# EAGLE board aircat (EAGLE 6.1)
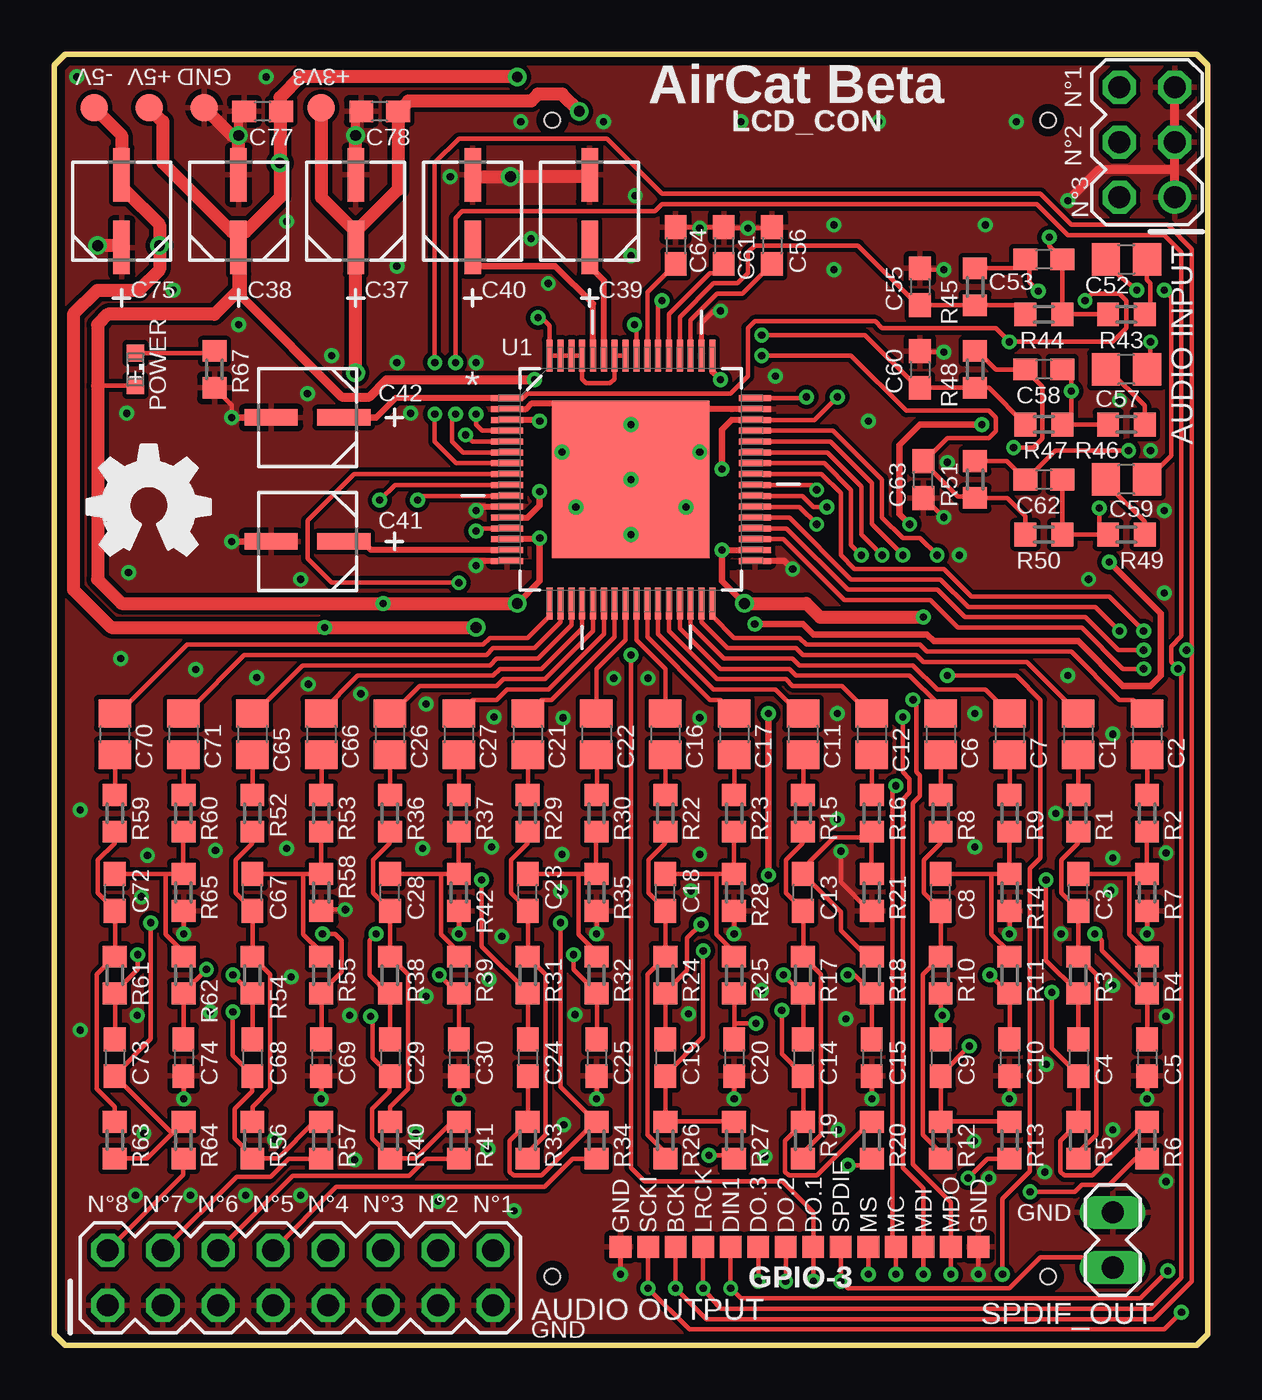
[diagram p2: board, top side]
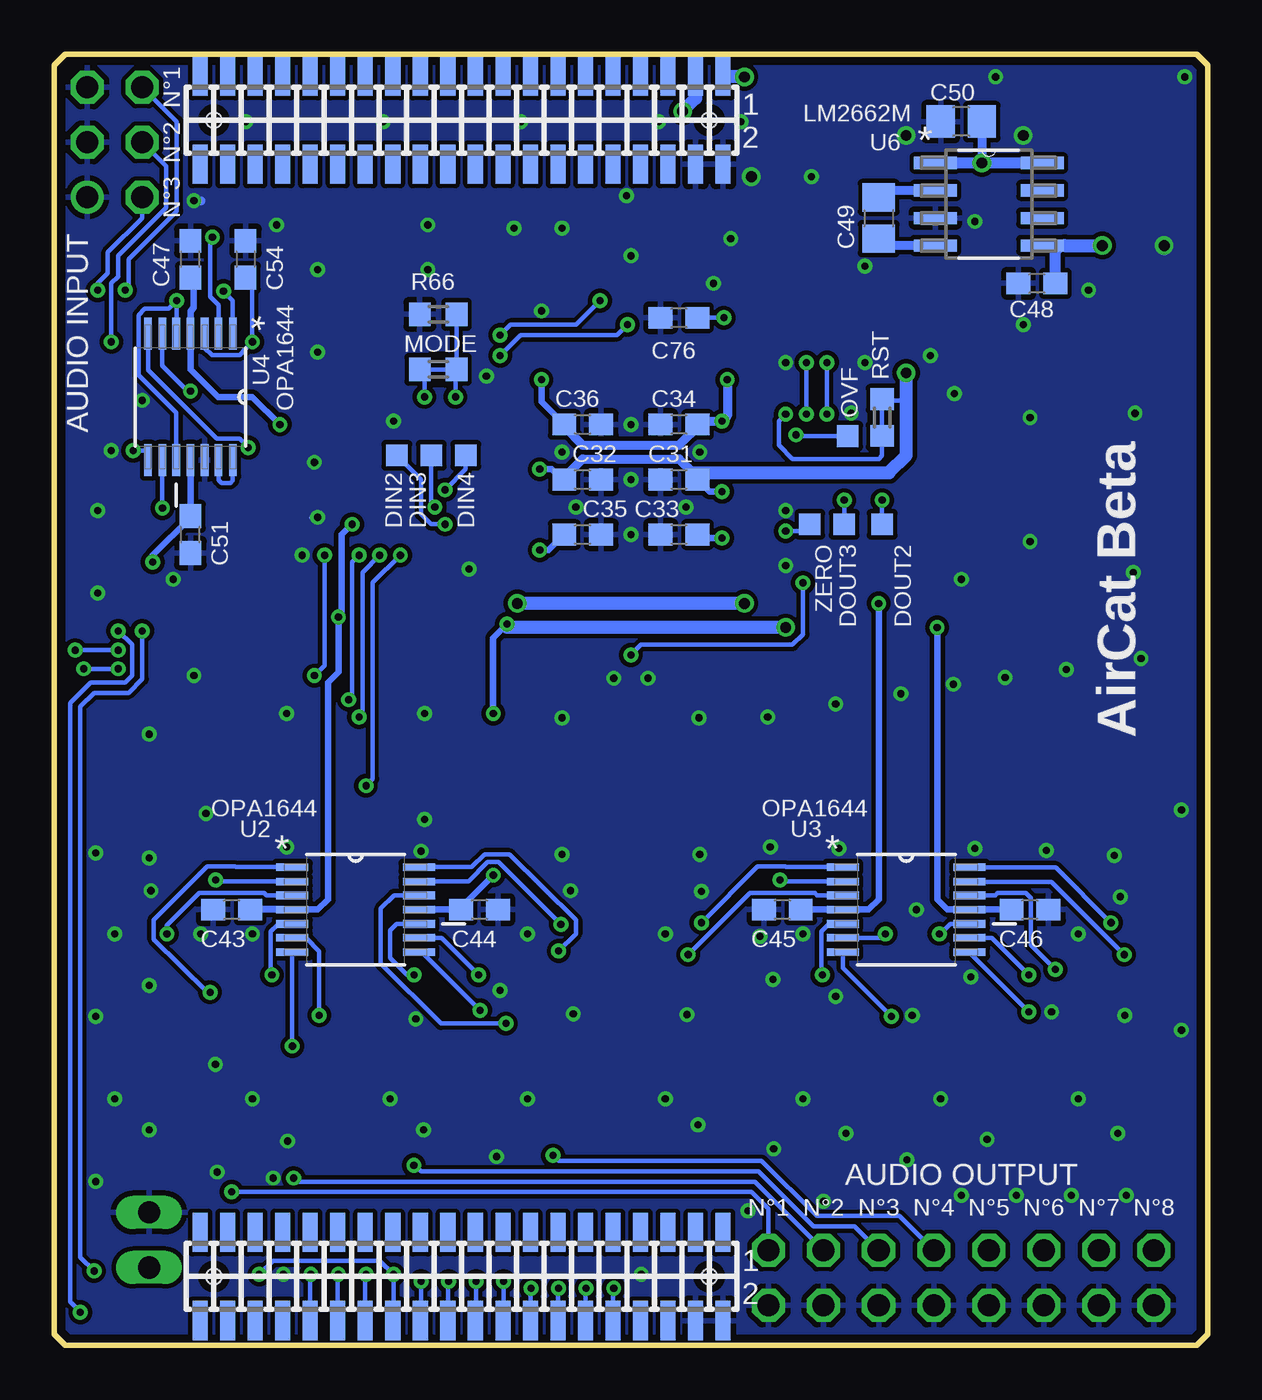
[diagram p3: board, bottom side, seen from below]

Size 53.21 x 59.56 mm. Coordinates in mm from the lower left corner, seen from the top.
Outline: 0,0.51 0,59.05 0.51,59.56 52.71,59.56 53.21,59.05 53.21,0.51 52.71,0 0.51,0 0,0.51
Copper layers (1*16): Top 0.0356mm / dielectric 1.5011mm / Bottom 0.0356mm
Design rules: minimum track width 6mil, minimum drill 13mil, track to track 6mil, track to pad 6mil, pad to pad 6mil, via to via 6mil, smd to smd 6mil, copper to edge 15mil, drill to drill 6mil, minimum pad ring 7mil, minimum via ring 7mil, stop-mask expansion 3mil, vias tented up to drill 0mil, thermal gap 10mil
Net classes: 0 default: width 0.203 mm, drill 0.33 mm
tRestrict: area 30.3,39.7 to 30.5,40.1; area 26.4,36.1 to 26.8,36.3; area 22.8,39.7 to 22.9,40.2; area 26.4,43.6 to 26.8,43.7; area 29.7,44.7 to 30,44.8; area 31.1,36 to 31.4,36.1; area 21.7,36 to 22,36.1; area 22.1,43.1 to 22.4,43.2; area 22.4,43.1 to 22.7,43.2; area 22.1,43.6 to 22.4,43.7; area 30.7,42.9 to 31,43; area 30.7,43.4 to 31,43.5; 1 more areas
bRestrict: area 15.2,42.5 to 15.5,43.1; area 14.5,42.5 to 14.9,43.1; area 35.2,45.2 to 35.8,45.7; area 35.2,44.4 to 35.8,44.9

## Footprints (pad centres in the part's own frame; a part is rotated, then mirrored left to right if it is on the bottom)
TP10SQ = smd 1 x 1: TP 0,0
C0805 = smd 1.3 x 1.5: 1 -0.95,0; 2 0.95,0
C0603 = smd 1.1 x 1: 1 -0.85,0; 2 0.85,0
CAPAE430X610N = smd 2.464 x 0.762: 1 -1.676,0; 2 1.676,0
A10_OLINUXINO_LIME_SHIELD = smd 0.7 x 1.8 bottom: 3-1 -4.255,-24.575; 3-2 -4.255,-28.639; 3-3 -2.985,-24.575; 3-4 -2.985,-28.639; 3-5 -1.714,-24.575; 3-6 -1.714,-28.639; 3-7 -0.445,-24.575; 3-8 -0.445,-28.639; 3-9 0.826,-24.575; 3-10 0.826,-28.639; 3-11 2.095,-24.575; 3-12 2.095,-28.639; 3-13 3.365,-24.575; 3-14 3.365,-28.639; 3-15 4.636,-24.575; 3-16 4.636,-28.639; 3-17 5.905,-24.575; 3-18 5.905,-28.639; 3-19 7.176,-24.575; 3-20 7.176,-28.639; 3-21 8.445,-24.575; 3-22 8.445,-28.639; 3-23 9.716,-24.575; 3-24 9.716,-28.639; 3-25 10.986,-24.575; 3-26 10.986,-28.639; 3-27 12.255,-24.575; 3-28 12.255,-28.639; 3-29 13.525,-24.575; 3-30 13.525,-28.639; 3-31 14.796,-24.575; 3-32 14.796,-28.639; 3-33 16.066,-24.575; 3-34 16.066,-28.639; 3-35 17.335,-24.575; 3-36 17.335,-28.639; 3-37 18.605,-24.575; 3-38 18.605,-28.639; 3-39 19.875,-24.575; 3-40 19.875,-28.639; D-1 -4.255,28.765; D-2 -4.255,24.701; D-3 -2.985,28.765; D-4 -2.985,24.701; D-5 -1.714,28.765; D-6 -1.714,24.701; D-7 -0.445,28.765; D-8 -0.445,24.701; D-9 0.826,28.765; D-10 0.826,24.701; D-11 2.095,28.765; D-12 2.095,24.701; D-13 3.365,28.765; D-14 3.365,24.701; D-15 4.636,28.765; D-16 4.636,24.701; D-17 5.905,28.765; D-18 5.905,24.701; D-19 7.176,28.765; D-20 7.176,24.701; D-21 8.445,28.765; D-22 8.445,24.701; D-23 9.716,28.765; D-24 9.716,24.701; D-25 10.986,28.765; D-26 10.986,24.701; D-27 12.255,28.765; D-28 12.255,24.701; D-29 13.525,28.765; D-30 13.525,24.701; D-31 14.796,28.765; D-32 14.796,24.701; D-33 16.066,28.765; D-34 16.066,24.701; D-35 17.335,28.765; D-36 17.335,24.701; D-37 18.605,28.765; D-38 18.605,24.701; D-39 19.875,28.765; D-40 19.875,24.701 | hole 0.7: -3.619,-26.607; 19.241,-26.607; -3.619,26.733; 19.241,26.733
MA08-2 = drill 1.016 octagon: 1 -8.89,-1.27; 2 -8.89,1.27; 3 -6.35,-1.27; 4 -6.35,1.27; 5 -3.81,-1.27; 6 -3.81,1.27; 7 -1.27,-1.27; 8 -1.27,1.27; 9 1.27,-1.27; 10 1.27,1.27; 11 3.81,-1.27; 12 3.81,1.27; 13 6.35,-1.27; 14 6.35,1.27; 15 8.89,-1.27; 16 8.89,1.27
MA03-2 = drill 1.016: 1 -2.54,-1.27 | drill 1.016 octagon: 2 -2.54,1.27; 3 0,-1.27; 4 0,1.27; 5 2.54,-1.27; 6 2.54,1.27
MA02-1 = drill 1.016 long: 1 -1.27,0; 2 1.27,0
R0603 = smd 1 x 1.1: 1 -0.85,0; 2 0.85,0
SML0603 = smd 0.8 x 0.8: A 0.75,0; C -0.75,0
B1,27 = smd 1.27 x 1.27: TP 0,0
QFP50P1200X1200X120-65N = smd 1.473 x 0.279: 1 -5.715,3.759; 2 -5.715,3.251; 3 -5.715,2.743; 4 -5.715,2.261; 5 -5.715,1.753; 6 -5.715,1.245; 7 -5.715,0.762; 8 -5.715,0.254; 9 -5.715,-0.254; 10 -5.715,-0.762; 11 -5.715,-1.245; 12 -5.715,-1.753; 13 -5.715,-2.261; 14 -5.715,-2.743; 15 -5.715,-3.251; 16 -5.715,-3.759; 33 5.715,-3.759; 34 5.715,-3.251; 35 5.715,-2.743; 36 5.715,-2.261; 37 5.715,-1.753; 38 5.715,-1.245; 39 5.715,-0.762; 40 5.715,-0.254; 41 5.715,0.254; 42 5.715,0.762; 43 5.715,1.245; 44 5.715,1.753; 45 5.715,2.261; 46 5.715,2.743; 47 5.715,3.251; 48 5.715,3.759 | smd 0.279 x 1.473: 17 -3.759,-5.715; 18 -3.251,-5.715; 19 -2.743,-5.715; 20 -2.261,-5.715; 21 -1.753,-5.715; 22 -1.245,-5.715; 23 -0.762,-5.715; 24 -0.254,-5.715; 25 0.254,-5.715; 26 0.762,-5.715; 27 1.245,-5.715; 28 1.753,-5.715; 29 2.261,-5.715; 30 2.743,-5.715; 31 3.251,-5.715; 32 3.759,-5.715; 49 3.759,5.715; 50 3.251,5.715; 51 2.743,5.715; 52 2.261,5.715; 53 1.753,5.715; 54 1.245,5.715; 55 0.762,5.715; 56 0.254,5.715; 57 -0.254,5.715; 58 -0.762,5.715; 59 -1.245,5.715; 60 -1.753,5.715; 61 -2.261,5.715; 62 -2.743,5.715; 63 -3.251,5.715; 64 -3.759,5.715 | smd 7.264 x 7.264: 65 0,0
SOP65P640X120-14N = smd 1.473 x 0.356: 1 -2.921,1.956; 2 -2.921,1.295; 3 -2.921,0.66; 4 -2.921,0; 5 -2.921,-0.66; 6 -2.921,-1.295; 7 -2.921,-1.956; 8 2.921,-1.956; 9 2.921,-1.295; 10 2.921,-0.66; 11 2.921,0; 12 2.921,0.66; 13 2.921,1.295; 14 2.921,1.956
SOIC127P620X175-8N = smd 1.981 x 0.559: 1 -2.464,1.905; 2 -2.464,0.635; 3 -2.464,-0.635; 4 -2.464,-1.905; 5 2.464,-1.905; 6 2.464,-0.635; 7 2.464,0.635; 8 2.464,1.905

## Placement (x,y rotation side)
BCKAD/DA  [TP10SQ]  28.67,4.54 0 top
C1  10µF 16V  [C0805]  47.24,28.19 270 top
C2  10µF 16V  [C0805]  50.42,28.19 270 top
C3  3300pF  [C0603]  47.24,20.89 90 top
C4  680pF  [C0603]  47.24,13.27 270 top
C5  680pF  [C0603]  50.42,13.27 270 top
C6  10µF 16V  [C0805]  40.89,28.19 270 top
C7  10µF 16V  [C0805]  44.07,28.19 270 top
C8  3300pF  [C0603]  40.89,20.89 90 top
C9  680pF  [C0603]  40.89,13.27 270 top
C10  680pF  [C0603]  44.07,13.27 270 top
C11  10µF 16V  [C0805]  34.54,28.19 270 top
C12  10µF 16V  [C0805]  37.72,28.19 270 top
C13  3300pF  [C0603]  34.54,20.89 90 top
C14  680pF  [C0603]  34.54,13.27 270 top
C15  680pF  [C0603]  37.72,13.27 270 top
C16  10µF 16V  [C0805]  28.19,28.19 270 top
C17  10µF 16V  [C0805]  31.37,28.19 270 top
C18  3300pF  [C0603]  28.19,20.89 90 top
C19  680pF  [C0603]  28.19,13.27 270 top
C20  680pF  [C0603]  31.37,13.27 270 top
C21  10µF 16V  [C0805]  21.84,28.19 270 top
C22  10µF 16V  [C0805]  25.02,28.19 270 top
C23  3300pF  [C0603]  21.84,20.89 90 top
C24  680pF  [C0603]  21.84,13.27 270 top
C25  680pF  [C0603]  25.02,13.27 270 top
C26  10µF 16V  [C0805]  15.49,28.19 270 top
C27  10µF 16V  [C0805]  18.67,28.19 270 top
C28  3300pF  [C0603]  15.49,20.89 90 top
C29  680pF  [C0603]  15.49,13.27 270 top
C30  680pF  [C0603]  18.67,13.27 270 top
C31  1µF  [C0603]  24.38,39.94 180 bottom
C32  1µF  [C0603]  28.83,39.94 0 bottom
C33  1µF  [C0603]  24.38,37.4 180 bottom
C34  1µF  [C0603]  24.38,42.48 180 bottom
C35  1µF  [C0603]  28.83,37.4 0 bottom
C36  1µF  [C0603]  28.83,42.48 0 bottom
C37  10µF  [CAPAE430X610N]  13.91,52.32 90 top
C38  10µF  [CAPAE430X610N]  8.51,52.32 90 top
C39  10µF  [CAPAE430X610N]  24.7,52.32 90 top
C40  10µF  [CAPAE430X610N]  19.3,52.32 90 top
C41  10µF  [CAPAE430X610N]  11.68,37.08 180 top
C42  10µF  [CAPAE430X610N]  11.68,42.8 180 top
C43  1µF  [C0603]  45.02,20.1 180 bottom
C44  1µF  [C0603]  33.59,20.1 180 bottom
C45  1µF  [C0603]  19.62,20.1 180 bottom
C46  1µF  [C0603]  8.19,20.1 180 bottom
C47  1µF  [C0603]  46.93,50.1 90 bottom
C48  100nF  [C0603]  7.87,48.99 180 bottom
C49  10µF  [C0805]  15.18,52.01 270 bottom
C50  10µF  [C0805]  11.37,56.45 180 bottom
C51  1µF  [C0603]  46.93,37.4 90 bottom
C52  10µF 16V  [C0805]  49.47,50.1 0 top
C53  2.2nF  [C0603]  45.66,50.1 180 top
C54  0.1µF  [C0603]  44.39,50.1 270 bottom
C55  22nF  [C0603]  39.94,48.83 270 top
C56  22nF  [C0603]  33.12,50.74 270 top
C57  10µF 16V  [C0805]  49.47,45.02 180 top
C58  2.2nF  [C0603]  45.66,45.02 180 top
C59  10µF 16V  [C0805]  49.47,39.94 180 top
C60  22nF  [C0603]  39.94,45.02 270 top
C61  22nF  [C0603]  30.89,50.74 270 top
C62  2.2nF  [C0603]  45.66,39.94 180 top
C63  22nF  [C0603]  40.1,39.94 90 top
C64  22nF  [C0603]  28.67,50.74 270 top
C65  10µF 16V  [C0805]  9.14,28.19 270 top
C66  10µF 16V  [C0805]  12.32,28.19 270 top
C67  3300pF  [C0603]  9.14,20.89 90 top
C68  680pF  [C0603]  9.14,13.27 270 top
C69  680pF  [C0603]  12.32,13.27 270 top
C70  10µF 16V  [C0805]  2.79,28.19 270 top
C71  10µF 16V  [C0805]  5.97,28.19 270 top
C72  3300pF  [C0603]  2.79,20.89 90 top
C73  680pF  [C0603]  2.79,13.27 270 top
C74  680pF  [C0603]  5.97,13.27 270 top
C75  10µF  [CAPAE430X610N]  3.11,52.32 90 top
C76  0.001-1µF  [C0603]  24.38,47.4 180 bottom
C77  100nF  [C0603]  9.62,56.93 180 top
C78  100nF  [C0603]  15.02,56.93 180 top
CON1  A10_OLINUXINO_LIME_SHIELD_TEMPLATE  [A10_OLINUXINO_LIME_SHIELD]  26.61,29.78 0 top
CON2  ANALOG_OUT  [MA08-2]  11.37,3.11 0 top
CON3  ANALOG_IN  [MA03-2]  50.42,55.5 90 top
CON4  SPDIF_OUT  [MA02-1]  48.83,4.86 270 top
DIN1  [TP10SQ]  31.21,4.54 0 top
DIN2  [TP10SQ]  37.4,41.05 180 bottom
DIN3  [TP10SQ]  35.81,41.05 180 bottom
DIN4  [TP10SQ]  34.23,41.05 180 bottom
DOUT1  [TP10SQ]  35.02,4.54 0 top
DOUT2  [TP10SQ]  15.02,37.88 0 bottom
DOUT2(NC)  TPTP10SQ  [TP10SQ]  33.75,4.54 0 top
DOUT3  [TP10SQ]  16.76,37.88 0 bottom
DOUT3(NC)  TPTP10SQ  [TP10SQ]  32.48,4.54 0 top
GND@1  TPTP10SQ  [TP10SQ]  26.13,4.54 0 top
GND@2  TPTP10SQ  [TP10SQ]  42.64,4.54 0 top
LOGO1  OSHW_LOGO_FILLX0200-NT  [OSHW_FILLX200_NOTEXT]  1.52,36.45 0 top
LRCKAD/DA  [TP10SQ]  29.94,4.54 0 top
MC  [TP10SQ]  38.83,4.54 0 top
MDI  [TP10SQ]  40.1,4.54 0 top
MDO  [TP10SQ]  41.37,4.54 0 top
MODE  0 Ohm  [R0603]  35.5,45.02 0 bottom
MS  [TP10SQ]  37.56,4.54 0 top
OVF  TPTP10SQ  [TP10SQ]  16.61,41.95 0 bottom
POWER  [SML0603]  3.75,45.02 270 top
R1  7.5k  [R0603]  47.24,24.54 270 top
R2  7.5k  [R0603]  50.42,24.54 270 top
R3  360  [R0603]  47.24,17.08 270 top
R4  360  [R0603]  50.42,17.08 270 top
R5  5.6k  [R0603]  47.24,9.46 90 top
R6  47  [R0603]  50.42,9.46 270 top
R7  5.6k  [R0603]  50.42,20.89 90 top
R8  7.5k  [R0603]  40.89,24.54 270 top
R9  7.5k  [R0603]  44.07,24.54 270 top
R10  360  [R0603]  40.89,17.08 270 top
R11  360  [R0603]  44.07,17.08 270 top
R12  5.6k  [R0603]  40.89,9.46 90 top
R13  47  [R0603]  44.07,9.46 270 top
R14  5.6k  [R0603]  44.07,20.89 90 top
R15  7.5k  [R0603]  34.54,24.54 270 top
R16  7.5k  [R0603]  37.72,24.54 270 top
R17  360  [R0603]  34.54,17.08 270 top
R18  360  [R0603]  37.72,17.08 270 top
R19  5.6k  [R0603]  34.54,9.46 90 top
R20  47  [R0603]  37.72,9.46 270 top
R21  5.6k  [R0603]  37.72,20.89 90 top
R22  7.5k  [R0603]  28.19,24.54 270 top
R23  7.5k  [R0603]  31.37,24.54 270 top
R24  360  [R0603]  28.19,17.08 270 top
R25  360  [R0603]  31.37,17.08 270 top
R26  5.6k  [R0603]  28.19,9.46 90 top
R27  47  [R0603]  31.37,9.46 270 top
R28  5.6k  [R0603]  31.37,20.89 90 top
R29  7.5k  [R0603]  21.84,24.54 270 top
R30  7.5k  [R0603]  25.02,24.54 270 top
R31  360  [R0603]  21.84,17.08 270 top
R32  360  [R0603]  25.02,17.08 270 top
R33  5.6k  [R0603]  21.84,9.46 90 top
R34  47  [R0603]  25.02,9.46 270 top
R35  5.6k  [R0603]  25.02,20.89 90 top
R36  7.5k  [R0603]  15.49,24.54 270 top
R37  7.5k  [R0603]  18.67,24.54 270 top
R38  360  [R0603]  15.49,17.08 270 top
R39  360  [R0603]  18.67,17.08 270 top
R40  5.6k  [R0603]  15.49,9.46 270 top
R41  47  [R0603]  18.67,9.46 270 top
R42  5.6k  [R0603]  18.67,20.89 90 top
R43  3k  [R0603]  49.47,47.56 180 top
R44  1.5k  [R0603]  45.66,47.56 180 top
R45  1.5k  [R0603]  42.48,48.83 270 top
R46  3k  [R0603]  49.47,42.48 180 top
R47  1.5k  [R0603]  45.66,42.48 180 top
R48  1.5k  [R0603]  42.48,45.02 270 top
R49  3k  [R0603]  49.47,37.4 180 top
R50  1.5k  [R0603]  45.66,37.4 180 top
R51  1.5k  [R0603]  42.48,39.94 270 top
R52  7.5k  [R0603]  9.14,24.54 270 top
R53  7.5k  [R0603]  12.32,24.54 270 top
R54  360  [R0603]  9.14,17.08 270 top
R55  360  [R0603]  12.32,17.08 270 top
R56  5.6k  [R0603]  9.14,9.46 270 top
R57  47  [R0603]  12.32,9.46 270 top
R58  5.6k  [R0603]  12.32,20.89 90 top
R59  7.5k  [R0603]  2.79,24.54 270 top
R60  7.5k  [R0603]  5.97,24.54 270 top
R61  360  [R0603]  2.79,17.08 270 top
R62  360  [R0603]  5.97,17.08 270 top
R63  5.6k  [R0603]  2.79,9.46 270 top
R64  47  [R0603]  5.97,9.46 270 top
R65  5.6k  [R0603]  5.97,20.89 90 top
R66  220k  [R0603]  35.5,47.56 0 bottom
R67  150  [R0603]  7.4,45.02 90 top
RST  0 Ohm  [R0603]  15.02,42.8 90 bottom
SCKI  [TP10SQ]  27.4,4.54 0 top
SPDIF_DO  TPTP10SQ  [TP10SQ]  36.29,4.54 0 top
TP1  -5V  [B1,27]  1.84,57.09 0 top
TP2  +5V  [B1,27]  4.38,57.09 0 top
TP3  GND  [B1,27]  6.92,57.09 0 top
TP4  +3V3  [B1,27]  12.32,57.09 0 top
U1  PCM3168A  [QFP50P1200X1200X120-65N]  26.61,39.94 0 top
U2  OPA1644AIPW  [SOP65P640X120-14N]  39.31,20.1 0 bottom
U3  OPA1644AIPW  [SOP65P640X120-14N]  13.91,20.1 0 bottom
U4  OPA1644AIPW  [SOP65P640X120-14N]  46.93,43.75 270 bottom
U6  LM2662M  [SOIC127P620X175-8N]  10.1,52.64 0 bottom
ZERO  [TP10SQ]  18.35,37.88 0 bottom

## Tracks (layer width: path | path; a pad name or v marks a point on that pad's centre or on a via)
+3V3  (via drill 0.33, 0.5)
  Top 0.203: U1.4 19.74,42.2 19.46,42.48 v19.46,42.96 | U1.48 34.65,43.7 v34.7,43.75 | U1.46 35.06,42.68 v36.13,43.75
  Top 0.279: U1.12 21.84,38.19 | U1.46 31.25,42.68
  Top 0.305: 21.84,38.19 22.4,38.75 v22.4,39.39 | 31.25,42.68 30.81,42.24 v30.81,40.42
  Top 0.61: v24.23,56.93 23.43,57.72 22.32,57.72 22,57.4 16.34,57.4 C78.1 15.87,53.33 13.91,51.37 | v13.91,44.86 C37.1 13.91,51.37 | TP4.TP 12.32,52.96 13.91,51.37
  Bottom 0.203: 13.91,43.59 15.02,43.59 RST.2 RST.1 15.02,41.05 15.18,40.89 19.15,40.89 19.78,41.53 19.78,42.64 v19.46,42.96 | v34.7,43.75 34.7,45.02 | 34.7,45.02 MODE.2 R66.2 | MODE.1 36.13,44.81 v36.13,43.75 | 34.7,45.02 MODE.1 | 36.45,45.02 MODE.1
  Bottom 0.305: v22.4,39.39 22.98,39.39 C31.1 | v30.81,40.42 30.26,40.42 29.78,39.94
  Bottom 0.406: C32.1 29.78,39.94 28.83,40.89 24.38,40.89 23.75,40.26 23.69,40.26 C31.1
  Bottom 0.61: CON1.D-3 23.62,57.53 v24.23,56.93 | 23.69,40.26 14.7,40.26 13.91,41.05 13.91,43.59 v13.91,44.86
+5V  (via drill 0.33, 0.5)
  Top 0.203: POWER.A 2,44.27
  Top 0.279: 22.36,42.68 U1.3 | 30.98,36.69 U1.34 | 22.36,37.2 U1.14 | U1.49 30.37,44.91 v30.73,44.55
  Top 0.305: v22.4,42.64 22.36,42.68 | 30.98,36.69 v30.81,36.69 30.81,35.26 v31.85,34.23 | 22.36,37.2 v22.4,37.24 22.4,35.26 v21.37,34.23 | v42.8,42.48 39.94,42.48 38.99,41.53 38.99,38.35 v39.47,37.88
  Top 0.406: 8.51,48.67 8.51,49.31 8.67,49.47 8.67,48.36 13.27,43.75 14.54,43.75 15.34,44.55 v22.16,44.55 | C77.1 10.41,57.56
  Top 0.61: 8.51,51.37 C38.1 8.51,48.67 7.4,47.56 2.48,47.56 2,47.09 2,44.27 2,35.34 3.11,34.23 v15.18,34.23 v21.37,34.23 | 8.51,51.37 8.51,51.47 | v21.37,58.52 11.37,58.52 10.41,57.56 v10.41,54.55 10.41,52.96 8.83,51.37 8.51,51.37 | 8.51,51.37 8.19,51.37 5.02,54.55 5.02,56.45 TP2.TP | v31.85,34.23 34.7,34.23 35.34,33.59 v40.1,33.59
  Bottom 0.203: 29.7,37.4 C35.1 29.62,37.4 | v10.41,54.55 v10.42,54.55 10.42,54.63
  Bottom 0.305: C34.1 23.27,42.48 23.11,42.64 | C33.1 23.06,37.24 v22.4,37.24 | C47.1 46.77,48.99 46.77,47.88 46.93,47.72 U4.4 46.93,45.02 45.66,43.75 44.07,43.75 v42.8,42.48 | C45.1 U3.4 16.7,20.1 | C45.1 18.99,20.1 | v15.18,34.23 15.18,20.57 15.65,20.1 16.7,20.1 | 18.99,20.31 C45.1 | 16.7,20.1 16.76,20.1 | U2.4 41.05,20.1 40.58,20.57 40.58,30.58 40.1,31.05 v40.1,33.59 39.94,33.75 39.94,37.4 v39.47,37.88 | v30.73,44.55 30.73,43.54 C36.1 | v30.81,36.69 30.42,36.69 29.7,37.4
  Bottom 0.33: U2.4 C43.1
  Bottom 0.406: C50.1 10.42,54.63 | 23.11,42.64 v22.4,42.64 22.16,42.88 v22.16,44.55 | 29.65,42.35 28.83,41.53 24.38,41.53 23.43,42.48 23.27,42.48 | 29.65,42.35 29.94,42.48 | C36.1 29.65,42.35
  Bottom 0.508: U6.1 v10.41,54.55 U6.8
  Bottom 0.61: CON1.D-1 21.4,58.55 v21.37,58.52 | v21.37,34.23 v31.85,34.23
-5V  (via drill 0.33, 0.5)
  Top 0.305: v32.96,21.69 v32.96,29.15 | v32.32,33.27 34.54,33.27 35.02,32.8 40.26,32.8 40.58,32.48 47.24,32.48 49.31,30.42 50.58,30.42 51.05,30.89 51.05,33.75 v48.67,36.13
  Top 0.61: v19.46,33.12 v12.48,33.12 2.64,33.12 0.89,34.86 0.89,47.56 2,48.67 3.91,48.67 4.86,49.63 v4.86,50.74 4.86,51.69 3.27,53.28 3.11,53.28 C75.2 3.11,55.82 TP1.TP
  Bottom 0.305: U4.11 46.93,38.67 | 46.93,38.2 48.67,36.45 v48.67,36.13 | v32.96,29.15 32.96,32.64 32.48,33.12 32.32,33.12 | C46.2 U3.11 | U3.11 12,20.1 12.48,20.57 v12.48,33.12 | U2.11 C44.2 | 34.23,20.1 34.23,20.42 v32.96,21.69 | U3.11
  Bottom 0.406: 46.93,38.2 C51.2 46.93,38.67 | C44.2 34.23,20.1
  Bottom 0.508: U6.5 6.76,50.74 | 6.76,50.74 6.61,50.74 | C48.1 7.02,50.48 6.76,50.74
  Bottom 0.61: v19.46,33.12 32.32,33.12 v32.32,33.27 | 6.61,50.74 v4.86,50.74 4.8,50.68
ANALOG_IN_1  (via drill 0.33)
  Top 0.203: v49.94,48.67 48.99,49.47 48.67,50.1 C52.1
  Bottom 0.203: CON3.6 47.56,56.45 47.56,52.32 49.78,50.1 49.78,48.83 v49.94,48.67
ANALOG_IN_2  (via drill 0.33)
  Top 0.203: v50.58,46.29 50.58,45.18 C57.1
  Bottom 0.203: v50.58,46.29 50.58,48.99 50.26,49.31 50.26,50.26 48.04,52.48 48.04,54.39 CON3.4
ANALOG_IN_3  (via drill 0.33)
  Top 0.203: 50.33,39.94 C59.1 51.53,41.05 51.53,48.36 v51.21,48.67
  Bottom 0.203: CON3.2 49.15,52.01 50.74,50.42 50.74,49.47 51.21,48.99 v51.21,48.67
ANALOG_OUT_1  (via drill 0.33)
  Top 0.203: R6.2 49.89,8.61 48.67,7.4 47.4,7.4 47.09,7.08 v45.02,7.08
  Bottom 0.203: v45.02,7.08 21.05,7.08 20.26,6.29 CON2.16
ANALOG_OUT_2  (via drill 0.33)
  Top 0.203: R13.2 44.06,8.6 43.05,8.6 v42.16,7.72
  Bottom 0.203: CON2.14 20.87,7.54 41.99,7.54 v42.16,7.72
ANALOG_OUT_3  (via drill 0.33)
  Top 0.203: v36.62,8.31 37.67,8.31 37.72,8.35 37.71,8.6 R20.2
  Bottom 0.203: v36.62,8.31 36.56,8.31 36.29,8.03 20.73,8.03 18.19,5.49 16.29,5.49 CON2.12
ANALOG_OUT_4  (via drill 0.33)
  Top 0.203: v30.2,8.76 31.3,8.76 | 31.3,8.76 31.37,8.67 | R27.2 31.31,8.61 31.3,8.76
  Bottom 0.203: CON2.10 14.22,5.97 18.03,5.97 20.57,8.51 29.94,8.51 30.03,8.6 v30.2,8.76
ANALOG_OUT_5
  Top 0.203: R34.2 25.01,8.6 23.92,8.6 22.63,7.3 13.02,7.3 CON2.8
ANALOG_OUT_6
  Top 0.203: R41.2 18.66,8.6 17.16,8.6 16.38,7.82 10.99,7.82 CON2.6
ANALOG_OUT_7
  Top 0.203: R57.2 12.31,8.6 10.81,8.6 9.99,7.78 8.41,7.78 CON2.4
ANALOG_OUT_8
  Top 0.203: R64.2 5.96,8.6 5.96,7.86 CON2.2
AOP_IN_A+  (via drill 0.33)
  Top 0.203: C5.1 50.43,14.14 50.43,16.22 R4.2 50.38,16.32 50.29,16.32 50.26,16.29 48.33,18.22 48.33,18.69 v48.01,18.99
  Bottom 0.203: U2.3 43.42,20.76 43.52,20.87 46.52,20.87 48.01,19.37 v48.01,18.99
AOP_IN_A-  (via drill 0.33)
  Top 0.203: C4.1 47.26,14.14 47.26,16.22 R3.2 47.21,16.32 45.76,17.77 v45.76,21.48
  Bottom 0.203: v45.76,21.48 45.68,21.4 U2.2
AOP_IN_B+  (via drill 0.33)
  Top 0.203: C10.1 44.08,14.14 44.08,16.22 R11.2 43.98,16.27 v43.17,17.08
  Bottom 0.203: v43.17,17.08 43.22,17.13 43.22,19.09 42.89,19.42 42.23,19.42 U2.5
AOP_IN_B-  (via drill 0.33)
  Top 0.203: 40.91,15.23 40.91,16.22 R10.2 | 40.91,15.23 40.91,14.14 C9.1 | v40.98,15.23 40.91,15.23
  Bottom 0.203: v40.98,15.23 40.98,18.17 41.59,18.78 42.23,18.78 U2.6
AOP_IN_C+  (via drill 0.33)
  Top 0.203: C15.1 37.73,14.14 37.73,16.22 R18.2 37.72,16.29 36.93,17.08 v36.61,17.08
  Bottom 0.203: U2.10 37.43,19.44 37.72,19.15 37.72,17.88 36.93,17.08 v36.61,17.08
AOP_IN_C-  (via drill 0.33)
  Top 0.203: C14.1 34.56,14.14 34.56,16.22 R17.2 34.46,16.27 v33.64,17.08
  Bottom 0.203: v33.64,17.08 35.34,18.78 36.39,18.78 U2.9
AOP_IN_D+  (via drill 0.33)
  Top 0.203: 31.38,14.85 31.38,16.22 R25.2 | 31.38,14.85 31.38,14.14 C20.1 | 31.38,14.85 v32.37,14.85
  Bottom 0.203: v32.37,14.85 35.37,14.85 38.15,17.62 38.15,20.15 37.53,20.76 U2.12 36.39,20.74
AOP_IN_D-  (via drill 0.33)
  Top 0.203: C19.1 28.21,14.14 28.21,16.22 R24.2 28.23,16.32 29.2,17.29 29.2,18.79 v29.84,19.42
  Bottom 0.203: v29.84,19.42 32.7,22.29 33.21,22.29 34.1,21.4 U2.13
AOP_IN_E+  (via drill 0.33)
  Top 0.203: C25.1 25.03,14.14 25.03,16.22 R32.2 24.98,16.32 23.96,17.34 v23.96,18.02
  Bottom 0.203: v23.96,18.02 21.12,20.87 18.12,20.87 18.02,20.76 U3.3
AOP_IN_E-  (via drill 0.33)
  Top 0.203: C24.1 21.86,14.14 21.86,16.22 R31.2 21.81,16.32 19.72,18.4 v19.72,21.48
  Bottom 0.203: v19.72,21.48 19.65,21.4 U3.2
AOP_IN_F+  (via drill 0.33)
  Top 0.203: C30.1 18.68,14.14 18.68,16.22 R39.2 18.58,16.27 v17.77,17.08
  Bottom 0.203: v17.77,17.08 17.82,17.13 17.82,19.09 17.49,19.42 16.83,19.42 U3.5
AOP_IN_F-  (via drill 0.33)
  Top 0.203: C29.1 15.51,14.14 15.51,16.22 R38.2 15.41,16.27 15.35,16.27 14.54,17.08 14.54,18.67 v14.86,18.99
  Bottom 0.203: U3.6 16.83,18.78 16.19,18.78 15.06,18.78 v14.86,18.99
AOP_IN_G+  (via drill 0.33)
  Top 0.203: C69.1 12.33,14.14 12.33,16.22 R55.2 12.36,16.32 13.17,17.13 13.27,17.23 13.27,18.67 12.95,18.99 v12.38,18.99
  Bottom 0.203: U3.10 11.87,19.44 12.32,18.99 v12.38,18.99
AOP_IN_G-  (via drill 0.33)
  Top 0.203: C68.1 9.16,14.14 9.16,16.22 R54.2 9.06,16.27 v8.24,17.08
  Bottom 0.203: v8.24,17.08 9.94,18.78 10.99,18.78 U3.9
AOP_IN_H+  (via drill 0.33)
  Top 0.203: C74.1 5.98,14.14 5.98,16.22 R62.2 6.01,16.32 v7.02,17.34
  Bottom 0.203: v7.02,17.34 8.17,18.48 8.17,20.64 8.39,20.87 9.69,20.87 9.79,20.76 U3.12
AOP_IN_H-  (via drill 0.33)
  Top 0.203: C73.1 2.81,14.14 2.81,16.22 R61.2 2.83,16.32 3.85,17.34 v3.85,18.02
  Bottom 0.203: v3.85,18.02 7.2,21.37 10.99,21.37 U3.13
AOP_IN_I-  (via drill 0.33)
  Top 0.203: R43.2 48.6,47.56 46.52,47.56 R44.1 46.52,47.64 46.52,50.1 C53.1 46.44,50.18 45.91,50.71 v45.91,51.12
  Bottom 0.203: U4.2 45.63,47.99 46.01,48.37 46.01,51.02 v45.91,51.12
AOP_IN_J-  (via drill 0.33)
  Top 0.203: R46.2 48.6,42.48 46.52,42.48 R47.1 46.93,42.9 v46.93,44.02 46.93,44.6 C58.1
  Bottom 0.203: U4.6 48.22,45.19 47.05,44.02 v46.93,44.02
AOP_IN_K-  (via drill 0.33)
  Top 0.203: C62.1 46.52,39.94 46.52,37.48 R50.1 46.52,37.4 48.6,37.4 R49.2 48.22,37.48 v48.22,38.63
  Bottom 0.203: v48.22,38.63 U4.9
AOP_OUT_A  (via drill 0.33)
  Top 0.203: R6.1 50.41,10.3 50.36,10.3 47.89,7.84 46.6,7.84 46.42,8.01 46.42,9.44 47.21,10.22 R5.2 47.26,10.33 47.26,12.41 C4.2 47.16,12.46 47.24,12.48 46.02,13.7 v46.02,16.29
  Bottom 0.203: v46.02,16.29 46.13,16.29 48.62,18.73 48.62,19.63 46.16,22.09 44.87,22.09 44.84,22.06 U2.1
AOP_OUT_B  (via drill 0.33)
  Top 0.203: R13.1 44.06,10.33 41.01,10.33 R12.2 40.91,10.33 40.91,12.41 C9.2 40.93,12.51 v42.23,13.8
  Bottom 0.203: v42.23,13.8 42.23,18.12 U2.7
AOP_OUT_C  (via drill 0.33)
  Top 0.203: R20.1 37.71,10.3 37.66,10.3 35.19,7.84 33.9,7.84 33.72,8.01 33.72,9.44 34.51,10.22 R19.2 34.56,10.33 34.56,12.41 C14.2 34.51,12.51 33.57,13.45 v33.57,15.46
  Bottom 0.203: v33.57,15.46 36.23,18.12 36.39,18.12 U2.8
AOP_OUT_D  (via drill 0.33)
  Top 0.203: C19.2 28.21,12.41 28.21,10.33 R26.2 28.31,10.33 31.36,10.33 R27.1 | 28.23,12.51 C19.2 | v29.94,18.19 29.94,14.22 28.19,12.48 C19.2
  Bottom 0.203: U2.14 33.95,22.06 33.36,22.64 32.19,22.64 29.15,19.62 29.15,18.99 v29.94,18.19
AOP_OUT_E  (via drill 0.33)
  Top 0.203: C24.2 21.86,12.41 21.86,10.33 R33.2 21.81,10.22 21.02,9.44 21.02,8.01 21.2,7.84 22.49,7.84 24.96,10.3 25.01,10.3 R34.1 24.9,10.38 23.36,11.93 v23.36,19.49
  Bottom 0.203: v23.36,19.49 20.76,22.09 19.47,22.09 19.44,22.06 U3.1
AOP_OUT_F  (via drill 0.33)
  Top 0.203: R41.1 18.66,10.3 18.35,10.3 16.68,8.62 15.51,8.62 R40.2 15.48,8.72 14.67,9.54 14.67,10.91 15.48,11.72 15.48,12.41 C29.2 15.41,12.46 15.41,12.57 14.7,13.27 14.7,15.02 14.54,15.18 v14.59,15.18
  Bottom 0.203: v14.59,15.18 16.83,17.41 16.83,18.12 U3.7
AOP_OUT_G  (via drill 0.33)
  Top 0.203: R57.1 12.31,10.3 12,10.3 10.33,8.62 9.16,8.62 R56.2 9.13,8.72 8.32,9.54 8.32,10.91 9.13,11.72 9.13,12.41 C68.2 9.11,12.51 8.24,13.37 v8.24,15.38
  Bottom 0.203: v8.24,15.38 10.99,18.12 U3.8
AOP_OUT_H  (via drill 0.33)
  Top 0.203: 5.44,9.78 5.96,10.3 R64.1 | 5.44,9.78 4.28,8.62 2.81,8.62 R63.2 | 5.44,9.78 5.37,9.84 2.81,12.41 C73.2 2.83,12.51 4.46,14.14 v4.46,19.49
  Bottom 0.203: v4.46,19.49 7,22.03 10.99,22.03 U3.14
AOP_OUT_I  (via drill 0.33)
  Top 0.203: R45.1 45.02,49.68 | 45.02,49.68 C53.2 | v45.4,48.63 44.99,49.04 44.99,49.65 | 44.99,49.65 44.94,49.7 | 45.02,49.68 44.99,49.65
  Bottom 0.203: U4.1 44.97,48.2 v45.4,48.63
AOP_OUT_J  (via drill 0.33)
  Top 0.203: v44.26,41.41 45.17,41.41 45.58,41.82 45.58,44.23 44.87,44.95 C58.2 43.43,45.02 42.64,45.82 42.54,45.82 R48.1
  Bottom 0.203: U4.7 48.88,44.98 45.72,41.82 44.67,41.82 v44.26,41.41
AOP_OUT_K  (via drill 0.33)
  Top 0.203: R51.1 43.96,40.79 C62.2 44.89,39.99 46.18,41.27 v49.57,41.27
  Bottom 0.203: v49.57,41.27 48.83,41.27 48.83,40.89 U4.8
AOP_OUT_L
  Bottom 0.203: U4.13 45.63,39.92 45.5,39.78 45.08,39.78 44.97,39.89 U4.14
AREFAD1
  Top 0.279: U1.59 25.36,49.12
  Top 0.305: 25.36,49.12 24.7,49.78 C39.1
BCKAD/DA  (via drill 0.33)
  Top 0.203: 52.48,32.07 52.48,2.95 50.74,1.21 30.1,1.21 v28.67,2.64 BCKAD/DA.TP | U1.7 18.54,40.7 17.56,41.69 v17.56,42.96 | v17.56,45.34 17.56,54.55 18.67,55.66 25.5,55.66 28.04,53.12 45.5,53.12 46.93,51.69 51.37,51.69 52.48,50.58 52.48,32.07 | U1.36 33.79,37.68 36.61,34.86 40.74,34.86 42.01,33.59 47.56,33.59 49.09,32.07 v50.26,32.07 | v52.24,32.07 52.48,32.07
  Bottom 0.203: CON1.3-12 28.7,2.6 v28.67,2.64 | v17.56,42.96 v17.56,45.34 | v50.26,32.07 v52.24,32.07
DIN1  (via drill 0.33)
  Top 0.203: v51.37,3.43 50.1,2.16 31.69,2.16 v31.21,2.64 DIN1.TP | U1.37 33.91,38.2 36.77,35.34 40.89,35.34 42.16,34.07 48.04,34.07 v49.15,32.96
  Bottom 0.203: CON1.3-16 31.24,2.51 v31.21,2.64 | v51.37,3.43 52.01,4.06 52.01,29.46 51.37,30.1 49.78,30.1 49.15,30.73 v49.15,32.96
DIN2  (via drill 0.33)
  Top 0.203: U1.38 32.35,38.67 34.39,38.67 v35.18,37.88
  Bottom 0.203: DIN2.TP 36.29,39.94 36.29,38.35 35.81,37.88 v35.18,37.88
DIN3  (via drill 0.33)
  Top 0.203: U1.39 34.51,39.18 35.02,38.67 v35.66,38.67
  Bottom 0.203: DIN3.TP 35.81,38.83 v35.66,38.67
DIN4  (via drill 0.33)
  Top 0.203: U1.40 34.96,39.69 v35.18,39.47
  Bottom 0.203: DIN4.TP 34.23,40.42 v35.18,39.47
DOUT1  (via drill 0.33)
  Top 0.203: v26.61,31.85 26.61,8.19 27.24,7.56 33.59,7.56 35.02,6.13 DOUT1.TP v35.02,2.95 | v18.67,35.18 12.8,35.18 11.68,36.29 11.68,38.04 13.84,40.2 U1.8
  Bottom 0.203: CON1.3-22 35.05,2.92 v35.02,2.95 | v26.61,31.85 26.13,32.32 19.15,32.32 18.67,32.8 v18.67,35.18
DOUT2  (via drill 0.33)
  Top 0.203: U1.9 15.72,39.69 v15.02,38.99
  Bottom 0.203: v15.02,38.99 DOUT2.TP
DOUT2(NC)  (via drill 0.33)
  Top 0.203: v33.75,2.95 DOUT2(NC).TP
  Bottom 0.203: CON1.3-20 33.75,1.14 v33.75,2.95
DOUT3  (via drill 0.33)
  Top 0.203: U1.10 16.95,39.18 v16.76,38.99
  Bottom 0.203: v16.76,38.99 DOUT3.TP
DOUT3(NC)  (via drill 0.33)
  Top 0.203: v32.48,2.95 DOUT3(NC).TP
  Bottom 0.203: CON1.3-18 32.48,1.14 v32.48,2.95
GND  (via drill 0.33, 0.5)
  Top 0.203: U1.50 29.86,47.16 30.42,47.72 v30.73,47.72 | 28.61,51.53 C64.1 C61.1 30.95,51.53 v32,51.53 33.06,51.53 C56.1 | v41.05,49.63 40,49.63 C55.1 | v41.05,45.82 40,45.82 C60.1 | C74.2 5.98,12.41 5.98,11.37 v5.97,11.37 | C69.2 12.33,12.41 12.33,11.37 v12.32,11.37 | C30.2 18.68,12.41 18.68,11.37 v18.67,11.37 | C25.2 25.03,12.41 25.03,11.37 v25.02,11.37 | C20.2 31.38,12.41 31.38,11.37 v31.37,11.37 | C15.2 37.73,12.41 37.73,11.37 v37.72,11.37 | C10.2 44.08,12.41 44.08,11.37 v44.07,11.37 | R65.1 5.98,20.03 5.98,18.99 v5.97,18.99 | R58.1 12.33,20.03 12.49,20.1 v13.43,20.1 | R42.1 18.68,20.03 18.68,18.99 v18.67,18.99 | R35.1 25.03,20.03 25.03,18.99 v25.02,18.99 | R28.1 31.38,20.03 31.38,18.99 v31.37,18.99 | 38.05,20.19 R21.1 37.62,20.04 36.29,21.37 v36.29,22.8 | R14.1 44.08,20.03 44.08,18.99 v44.07,18.99 | C5.2 50.43,12.41 50.43,11.37 v50.42,11.37 | R7.1 50.43,20.03 50.43,18.99 v50.42,18.99 | C63.1 40.16,39.09 v41.05,38.2 | R67.1 8.19,43.38 v8.19,42.8 | GND@1.TP v26.13,3.27 | GND@2.TP v42.64,3.27
  Top 0.279: U1.2 21.76,43.19 22,43.43 23.27,43.43 v23.43,41.21 | 19.65,38.7 U1.11 | U1.16 19.67,36.18 v19.46,35.97 | U1.47 30.18,43.19 | v34.07,35.81 33.7,36.18 U1.33
  Top 0.305: C42.2 v8.19,42.8 | C41.2 v8.19,37.08 | v19.46,38.51 19.65,38.7 | v29.78,41.21 29.94,42.96 30.18,43.19 | 8.19,55.82 v8.51,55.82
  Top 0.406: 28.57,51.69 C64.1 | v8.51,55.82 8.51,56.67 C77.2 | v13.91,55.82 13.91,56.67 C78.2 | 51.69,54.23 CON3.5 | CON3.1 51.69,54.23 | 51.69,54.23 48.2,54.23 v46.77,52.8
  Top 0.61: C38.2 v8.51,55.82 | C37.2 v13.91,55.82 | C39.2 24.61,53.91 v21.05,53.91 19.3,53.91 C40.2 | TP3.TP 8.19,55.82 | C75.1 3.18,50.74 v2,50.74
  Bottom 0.203: 22.42,54.44 CON1.D-2 | v41.05,38.2 41.37,38.2 | v26.13,3.27 25.97,3.27 | v42.64,3.27 42.48,3.27
  Bottom 0.406: v46.77,52.8 46.45,52.8
  Bottom 0.61: v2,50.74 2,50.58
  other vias: 26.61,42.48 29.15,38.67 26.61,37.4 24.07,38.67 26.61,39.94 1.05,58.52 12.8,45.66 11.68,43.91 8.51,47.09 3.43,35.66 11.37,35.34 9.78,58.52 5.49,48.67 10.73,51.85 21.53,56.45 15.81,45.34 15.81,49.78 22,51.05 19.46,45.34 22.8,48.99 26.61,50.26 29.78,51.53 35.97,51.69 42.96,51.69 25.34,56.45 35.97,49.63 31.69,56.45 38.04,56.45 44.39,56.45 37.56,42.64 33.27,44.7 41.21,40.74 47.72,35.34 51.21,34.7 51.21,38.51 50.58,41.27 49.15,43.59 46.77,30.89 48.83,22.48 48.83,28.19 51.29,22.72 46.21,24.54 51.29,15.18 51.29,7.56 48.83,9.94 48.83,16.61 43.12,7.72 21.21,6.21 17.72,6.64 11.37,6.92 8.83,6.92 6.29,6.92 3.75,6.92 4.14,9.78 1.21,14.54 1.21,24.7 3.07,31.69 6.52,31.17 9.34,30.81 11.72,30.5 14.14,30.06 17.16,29.58 20.3,28.99 23.47,28.95 25.81,30.77 27.4,30.77 29.78,28.95 36.13,29.15 42.48,29.15 4.3,22.6 7.44,22.84 10.73,22.92 4.02,20.69 3.83,15.22 10.93,17 10.18,9.5 13.87,8.55 13.63,15.22 7.2,15.37 16.68,9.78 17.16,16.09 20.06,16.88 20.02,9.06 23.51,10.18 23.35,20.93 29.27,15.3 29.38,20.97 24.03,15.26 32.8,8.71 32.64,16.37 36.17,9.94 36.53,15.06 42.44,9.42 45.7,7.99 45.78,12.95 46.45,18.99 48.75,20.97 42.48,22.99 36.13,24.26 29.78,22.64 23.43,22.64 20.18,22.99 20.65,18.87 17,22.92 41.77,36.45 18.27,53.91 3.35,43 16.45,43 26.8,53.04
  pour Bottom (isolate 0.203): 0,59.05 0.55,59.56 52.7,59.56 53.21,59.05 53.21,0.51 52.7,0 0.51,0 0,0.51
  pour Top (isolate 0.203): 0,59.05 0.55,59.56 52.7,59.56 53.21,59.05 53.21,0.51 52.7,0 0.51,0 0,0.51
LRCKAD/DA  (via drill 0.33)
  Top 0.203: U1.6 18.85,41.19 18.35,41.69 18.35,42.8 v18.51,42.96 | v18.51,45.34 18.51,52.01 18.83,52.32 27.72,52.32 28.04,52.64 45.34,52.64 46.77,51.21 51.21,51.21 52.01,50.42 52.01,32.72 51.53,32.24 51.53,31.53 v51.85,31.21 52.01,31.05 52.01,3.11 50.58,1.68 30.73,1.68 v29.94,2.64 LRCKAD/DA.TP | U1.35 33.64,37.2 36.45,34.39 40.42,34.39 41.69,33.12 47.4,33.12 49.31,31.21 v50.26,31.21
  Bottom 0.203: CON1.3-14 29.97,2.6 v29.94,2.64 | v18.51,42.96 v18.51,45.34 | v50.26,31.21 v51.85,31.21
MC  (via drill 0.33)
  Top 0.203: v38.83,25.81 38.67,25.65 38.67,4.54 MC.TP v38.83,3.27 | U1.42 35.53,40.7 36.77,39.47 36.77,36.93 v37.24,36.45
  Bottom 0.203: CON1.3-28 38.86,3.24 v38.83,3.27 | v38.83,25.81 38.51,26.13 38.51,35.18 v37.24,36.45
MDI  (via drill 0.33)
  Top 0.203: v39.15,28.99 39.15,26.45 39.47,26.13 39.47,25.5 39.15,25.18 39.15,8.19 40.1,7.24 MDI.TP v40.1,3.27 | U1.43 35.68,41.19 37.24,39.62 37.24,37.4 v38.2,36.45
  Bottom 0.203: CON1.3-30 40.13,3.24 v40.1,3.27 | v39.15,28.99 38.99,29.15 38.99,35.66 v38.2,36.45
MDO  (via drill 0.33)
  Top 0.203: v39.62,29.78 39.78,29.62 39.78,26.45 39.94,26.29 39.94,25.34 39.62,25.02 39.62,8.35 41.37,6.6 MDO.TP v41.37,3.27 | U1.44 35.81,41.69 37.72,39.78 37.72,37.88 v39.15,36.45
  Bottom 0.203: CON1.3-32 41.4,3.24 v41.37,3.27 | v39.15,36.45 39.47,36.13 39.47,29.94 v39.62,29.78
MS  (via drill 0.33)
  Top 0.203: v41.21,30.89 44.39,30.89 45.5,29.78 45.5,22.48 45.02,22 45.02,8.03 43.75,6.76 v43.75,3.27 | U1.45 35.93,42.2 38.2,39.94 38.2,38.2 39.15,37.24 39.94,37.24 v40.74,36.45 | v37.56,3.27 MS.TP
  Bottom 0.203: v43.75,3.27 43.12,3.91 38.2,3.91 v37.56,3.27 37.56,1.14 CON1.3-26 | v41.21,30.89 40.74,31.37 v40.74,36.45
N$1
  Top 0.203: R2.1 50.43,25.57 50.43,27.65 C2.2
N$2
  Top 0.203: R1.1 47.26,25.57 47.26,27.65 C1.2
N$3
  Top 0.203: R5.1 47.26,8.62 47.26,8.9 48.07,9.72 48.07,17.11 47.26,17.92 R3.1 47.26,18.02 47.26,20.03 C3.1 47.21,20.13 46.47,20.87 46.47,22.39 47.23,23.15 47.23,23.84 R1.2
N$4
  Top 0.203: 49.59,21.76 50.41,21.76 R7.2 50.41,21.86 50.41,23.84 R2.2 | 49.59,21.76 47.26,21.76 C3.2 | R4.1 50.41,17.95 50.41,18.15 49.59,18.96 49.59,21.68 49.59,21.76
N$5
  Top 0.203: R9.1 44.08,25.57 44.08,27.65 C7.2
N$6
  Top 0.203: R8.1 40.91,25.57 40.91,27.65 C6.2
N$7
  Top 0.203: R12.1 40.88,8.62 40.88,8.9 40.07,9.72 40.07,17.11 40.88,17.92 R10.1 40.91,18.02 40.91,20.03 C8.1 40.86,20.13 40.12,20.87 40.12,22.39 40.88,23.15 40.88,23.84 R8.2
N$8
  Top 0.203: 43.24,21.76 44.06,21.76 R14.2 44.06,21.86 44.06,23.84 R9.2 | 43.24,21.76 40.91,21.76 C8.2 | R11.1 44.06,17.95 44.06,18.15 43.24,18.96 43.24,21.68 43.24,21.76
N$9
  Top 0.203: R16.1 37.73,25.57 37.73,27.65 C12.2
N$10
  Top 0.203: R15.1 34.56,25.57 34.56,27.65 C11.2
N$11
  Top 0.203: R19.1 34.56,8.62 34.56,8.9 35.37,9.72 35.37,17.11 34.56,17.92 R17.1 34.56,18.02 34.56,20.03 C13.1 34.51,20.13 33.77,20.87 33.77,22.39 34.53,23.15 34.53,23.84 R15.2
N$12
  Top 0.203: R21.2 37.71,21.86 37.71,23.84 R16.2 37.3,23.43 35.97,23.43 34.54,22 C13.2 36.29,20 36.29,19.15 37.5,17.93 R18.1
N$13
  Top 0.203: R23.1 31.38,25.57 31.38,27.65 C17.2
N$14
  Top 0.203: R22.1 28.21,25.57 28.21,27.65 C16.2
N$15
  Top 0.203: R26.1 28.18,8.62 28.18,8.9 27.37,9.72 27.37,17.11 28.18,17.92 R24.1 28.21,18.02 28.21,20.03 C18.1 28.16,20.13 27.42,20.87 27.42,22.39 28.18,23.15 28.18,23.84 R22.2
N$16
  Top 0.203: 30.54,21.76 31.36,21.76 R28.2 31.36,21.86 31.36,23.84 R23.2 | 30.54,21.76 28.21,21.76 C18.2 | R25.1 31.36,17.95 31.36,18.15 30.54,18.96 30.54,21.68 30.54,21.76
N$17
  Top 0.203: R30.1 25.03,25.57 25.03,27.65 C22.2
N$18
  Top 0.203: R29.1 21.86,25.57 21.86,27.65 C21.2
N$19
  Top 0.203: R33.1 21.86,8.62 21.86,8.9 22.67,9.72 22.67,17.11 21.86,17.92 R31.1 21.86,18.02 21.86,20.03 C23.1 21.81,20.13 21.07,20.87 21.07,22.39 21.83,23.15 21.83,23.84 R29.2
N$20
  Top 0.203: 24.19,21.76 25.01,21.76 R35.2 25.01,21.86 25.01,23.84 R30.2 | 24.19,21.76 21.86,21.76 C23.2 | R32.1 25.01,17.95 25.01,18.15 24.19,18.96 24.19,21.68 24.19,21.76
N$21
  Top 0.203: R37.1 18.68,25.57 18.68,27.65 C27.2
N$22
  Top 0.203: R36.1 15.51,25.57 15.51,27.65 C26.2
N$23
  Top 0.203: R40.1 15.51,10.33 15.51,11.01 16.32,11.82 16.32,17.11 15.51,17.92 R38.1 15.51,18.02 15.51,20.03 C28.1 15.46,20.13 14.72,20.87 14.72,22.39 15.48,23.15 15.48,23.84 R36.2
N$24
  Top 0.203: 17.84,21.76 18.66,21.76 R42.2 18.66,21.86 18.66,23.84 R37.2 | 17.84,21.76 15.51,21.76 C28.2 | R39.1 18.66,17.95 18.66,18.15 17.84,18.96 17.84,21.68 17.84,21.76
N$25
  Top 0.203: 50.3,47.56 R43.1 | C52.2 50.42,49.15 50.58,48.99 50.58,47.72 50.42,47.56 R43.1 | 50.26,47.56 R43.1
N$26
  Top 0.203: R46.1 50.3,42.48 50.3,43.35 48.63,45.02 C57.2
N$27
  Top 0.203: R49.1 50.3,37.4 50.3,37.99 48.67,39.62 48.63,39.67 48.63,39.94 C59.2
N$28
  Top 0.203: R53.1 12.33,25.57 12.33,27.65 C66.2
N$29
  Top 0.203: R52.1 9.16,25.57 9.16,27.65 C65.2
N$30
  Top 0.203: R56.1 9.16,10.33 9.16,11.01 9.97,11.82 9.97,17.11 9.16,17.92 R54.1 9.16,18.02 9.16,20.03 C67.1 9.11,20.13 8.37,20.87 8.37,22.39 9.13,23.15 9.13,23.84 R52.2
N$31
  Top 0.203: 11.49,21.76 12.31,21.76 R58.2 12.31,21.86 12.31,23.84 R53.2 | 11.49,21.76 9.16,21.76 C67.2 | R55.1 12.31,17.95 12.31,18.15 11.49,18.96 11.49,21.68 11.49,21.76
N$32
  Top 0.203: R60.1 5.98,25.57 5.98,27.65 C71.2
N$33
  Top 0.203: R59.1 2.81,25.57 2.81,27.65 C70.2
N$34
  Bottom 0.406: U6.2 14.86,53.28 C49.1
N$35
  Bottom 0.203: C49.2 15.15,51.07 15.01,51.21
  Bottom 0.406: U6.4 14.54,50.74 15.01,51.21 15.18,51.37
N$36
  Top 0.203: R63.1 2.78,10.33 2.78,11.01 1.97,11.82 1.97,17.11 2.78,17.92 R61.1 2.81,18.02 2.81,20.03 C72.1 2.76,20.13 2.02,20.87 2.02,22.39 2.78,23.15 2.78,23.84 R59.2
N$37
  Top 0.203: 5.14,21.76 5.96,21.76 R65.2 5.96,21.86 5.96,23.84 R60.2 | 5.14,21.76 2.81,21.76 C72.2 | R62.1 5.96,17.95 5.96,18.15 5.14,18.96 5.14,21.68 5.14,21.76
N$38
  Top 0.203: POWER.C 7.4,45.77 R67.2
OVF  (via drill 0.33)
  Top 0.203: U1.5 19.3,41.69 v18.99,42.01
  Bottom 0.203: OVF.TP 18.93,41.95 v18.99,42.01
SCKI  (via drill 0.33)
  Top 0.203: v52.01,1.52 51.21,0.73 29.31,0.73 v27.4,2.64 SCKI.TP | v50.26,32.96 48.67,34.54 42.32,34.54 41.05,35.81 36.93,35.81 36.29,36.45 36.29,39.31 35.4,40.2 U1.41
  Bottom 0.203: CON1.3-10 27.43,2.6 v27.4,2.64 | v52.01,1.52 52.48,2 52.48,29.62 51.53,30.58 49.94,30.58 49.63,30.89 49.63,32.32 v50.26,32.96
SPDIF_DO  (via drill 0.33)
  Top 0.203: CON4.2 47.88,3.59 47.4,4.06 45.5,4.06 44.07,2.64 36.61,2.64 v36.29,2.95 SPDIF_DO.TP
  Bottom 0.203: CON1.3-24 36.29,1.17 v36.29,2.95
VCOMAD  (via drill 0.33)
  Top 0.203: U1.1 21.63,43.7 21.84,43.91 31.21,43.91 32,44.7 32,46.93 32.32,47.24 37.88,47.24 38.2,46.93 43.43,46.93 v44.07,46.29 48.83,46.29 49.47,46.93 49.47,48.2 49.15,48.51 47.88,48.51 v47.56,48.2
  Top 0.279: U1.1 15.76,43.7
  Top 0.305: 15.76,43.7 14.86,42.8 C42.1
  Bottom 0.203: U4.3 46.27,46.01 45.94,45.68 44.67,45.68 v44.07,46.29 44.07,48.93 C54.2 44.44,49.34 44.44,49.57 | U4.10 47.59,43.02 49.31,44.75 49.31,47.54 49.03,47.82 47.94,47.82 v47.56,48.2 47.56,47.36 47.59,47.33 U4.5 47.56,46.65
VCOMDA
  Top 0.279: 14.22,37.08 14.62,36.69 U1.15
  Top 0.305: 14.22,37.08 C41.1
VIN1+
  Top 0.203: U1.52 28.87,47.44 30.42,48.99 31.53,48.99 32,49.47 32,50.42 32.32,50.74 37.08,50.74 39.84,47.98 C55.2 R45.2 44.39,47.98 R44.2
VIN1-
  Top 0.203: U1.51 29.35,47.29 30.58,48.51 31.74,48.51 C56.2
VIN2+  (via drill 0.33)
  Top 0.203: R47.2 43.12,44.17 R48.2 C60.2 39.84,44.17 37.4,46.61 v32.64,46.61 | U1.54 27.85,48.01 v28.04,48.2
  Bottom 0.203: v28.04,48.2 29.15,47.09 32.16,47.09 v32.64,46.61
VIN2-
  Top 0.203: U1.53 28.36,47.57 30.26,49.47 30.58,49.47 30.68,49.57 30.68,49.89 C61.2
VIN3+  (via drill 0.33)
  Top 0.203: v26.77,47.09 26.86,46.99 U1.56 | 40.1,40.74 41.21,41.85 43.12,41.85 43.43,42.16 43.43,42.8 43.12,43.12 39.31,43.12 36.77,45.66 v32.64,45.66 | R50.2 44.81,38.25 43.97,39.09 R51.2 42.43,39.15 41.69,39.15 40.1,40.74 | 40.1,40.74 C63.2
  Bottom 0.203: v32.64,45.66 31.69,46.61 27.24,46.61 v26.77,47.09
VIN3-
  Top 0.203: U1.55 27.37,48.58 C64.2
VIN4-6  (via drill 0.33)
  Top 0.203: U1.57 U1.58 25.84,44.58 25.65,44.39 24.54,44.39 24.35,44.58 U1.61 U1.62 U1.63 U1.64 22.85,47.03 22.48,47.4 v22.32,47.4
  Bottom 0.203: v22.32,47.4 C76.1
VOUT1+
  Top 0.203: U1.31 29.86,33.36 31.05,32.16 34.23,32.16 34.54,31.85 39.78,31.85 40.1,31.53 44.86,31.53 C1.1
VOUT1-
  Top 0.203: U1.32 30.37,33.64 31.37,32.64 34.39,32.64 34.7,32.32 39.94,32.32 40.26,32 46.93,32 49.15,29.78 49.78,29.78 C2.1
VOUT2+
  Top 0.203: U1.29 28.87,33.08 30.73,31.21 33.91,31.21 34.23,30.89 39.47,30.89 40.74,29.62 40.74,29.3 C6.1
VOUT2-
  Top 0.203: U1.30 29.35,33.23 30.89,31.69 34.07,31.69 34.39,31.37 39.62,31.37 40.74,30.26 42.96,30.26 C7.1
VOUT3+
  Top 0.203: U1.27 27.85,32.82 30.42,30.26 33.27,30.26 34.39,29.15 C11.1 | C11.1 34.7,29.15 | C11.1
VOUT3-
  Top 0.203: U1.28 28.36,32.95 30.58,30.73 33.75,30.73 34.07,30.42 36.35,30.42 37.62,29.14 C12.1
VOUT4+
  Top 0.203: U1.25 26.86,32.54 28.19,31.21 C16.1
VOUT4-
  Top 0.203: U1.26 27.37,32.67 30.26,29.78 30.73,29.78 C17.1 31.37,29.31
VOUT5+
  Top 0.203: U1.23 25.84,32.67 22.96,29.78 22.48,29.78 C21.1
VOUT5-
  Top 0.203: U1.24 26.35,32.54 25.02,31.21 C22.1
VOUT6+
  Top 0.203: U1.21 24.85,32.95 22.64,30.73 20.73,30.73 20.42,30.42 16.87,30.42 15.6,29.15 C26.1
VOUT6-
  Top 0.203: U1.22 25.36,32.82 22.8,30.26 20.89,30.26 20.42,29.78 19.31,29.78 C27.1
VOUT7+
  Top 0.203: U1.19 23.86,33.23 22.32,31.69 20.42,31.69 20.1,31.37 11.47,31.37 9.25,29.15 C65.1
VOUT7-
  Top 0.203: U1.20 24.35,33.08 22.48,31.21 20.57,31.21 20.26,30.89 14.01,30.89 12.32,29.2 C66.1
VOUT8+
  Top 0.203: U1.17 22.85,33.64 21.84,32.64 20.1,32.64 19.78,32.32 17.13,32.32 16.45,32.32 6.13,32.32 2.95,29.14 C70.1
VOUT8-
  Top 0.203: U1.18 23.36,33.36 22.16,32.16 20.26,32.16 19.94,31.85 8.77,31.85 6.29,29.36 C71.1
VREFAD2
  Top 0.279: U1.60 24.85,48.04
  Top 0.305: 24.85,48.04 23.11,49.78 19.3,49.78 C40.1
ZERO  (via drill 0.33)
  Top 0.203: U1.13 19.5,37.68 v19.46,37.56
  Bottom 0.203: v19.46,37.56 18.51,37.56 ZERO.TP

## Text on the board
tPlace: AirCat Beta
bPlace: AirCat Beta
tNames: -5V | +5V | GND | +3V3 | N°1 | N°2 | N°3 | AUDIO INPUT | + | N°8 | N°7 | N°6 | N°5 | N°4 | N°3 | N°2 | N°1 | GND | GND | SCKI | BCK | LRCK | DIN1 | DO.3 | DO.2 | DO.1 | SPDIF | MS | MC | MDI | MDO | GND | AUDIO OUTPUT | SPDIF_OUT | GND
bNames: N°1 | LM2662M | N°2 | N°3 | AUDIO INPUT | OPA1644 | OPA1644 | OPA1644 | AUDIO OUTPUT | N°8 | N°7 | N°6 | N°5 | N°4 | N°3 | N°2 | N°1